# Altium project WARROX.PrjPcb
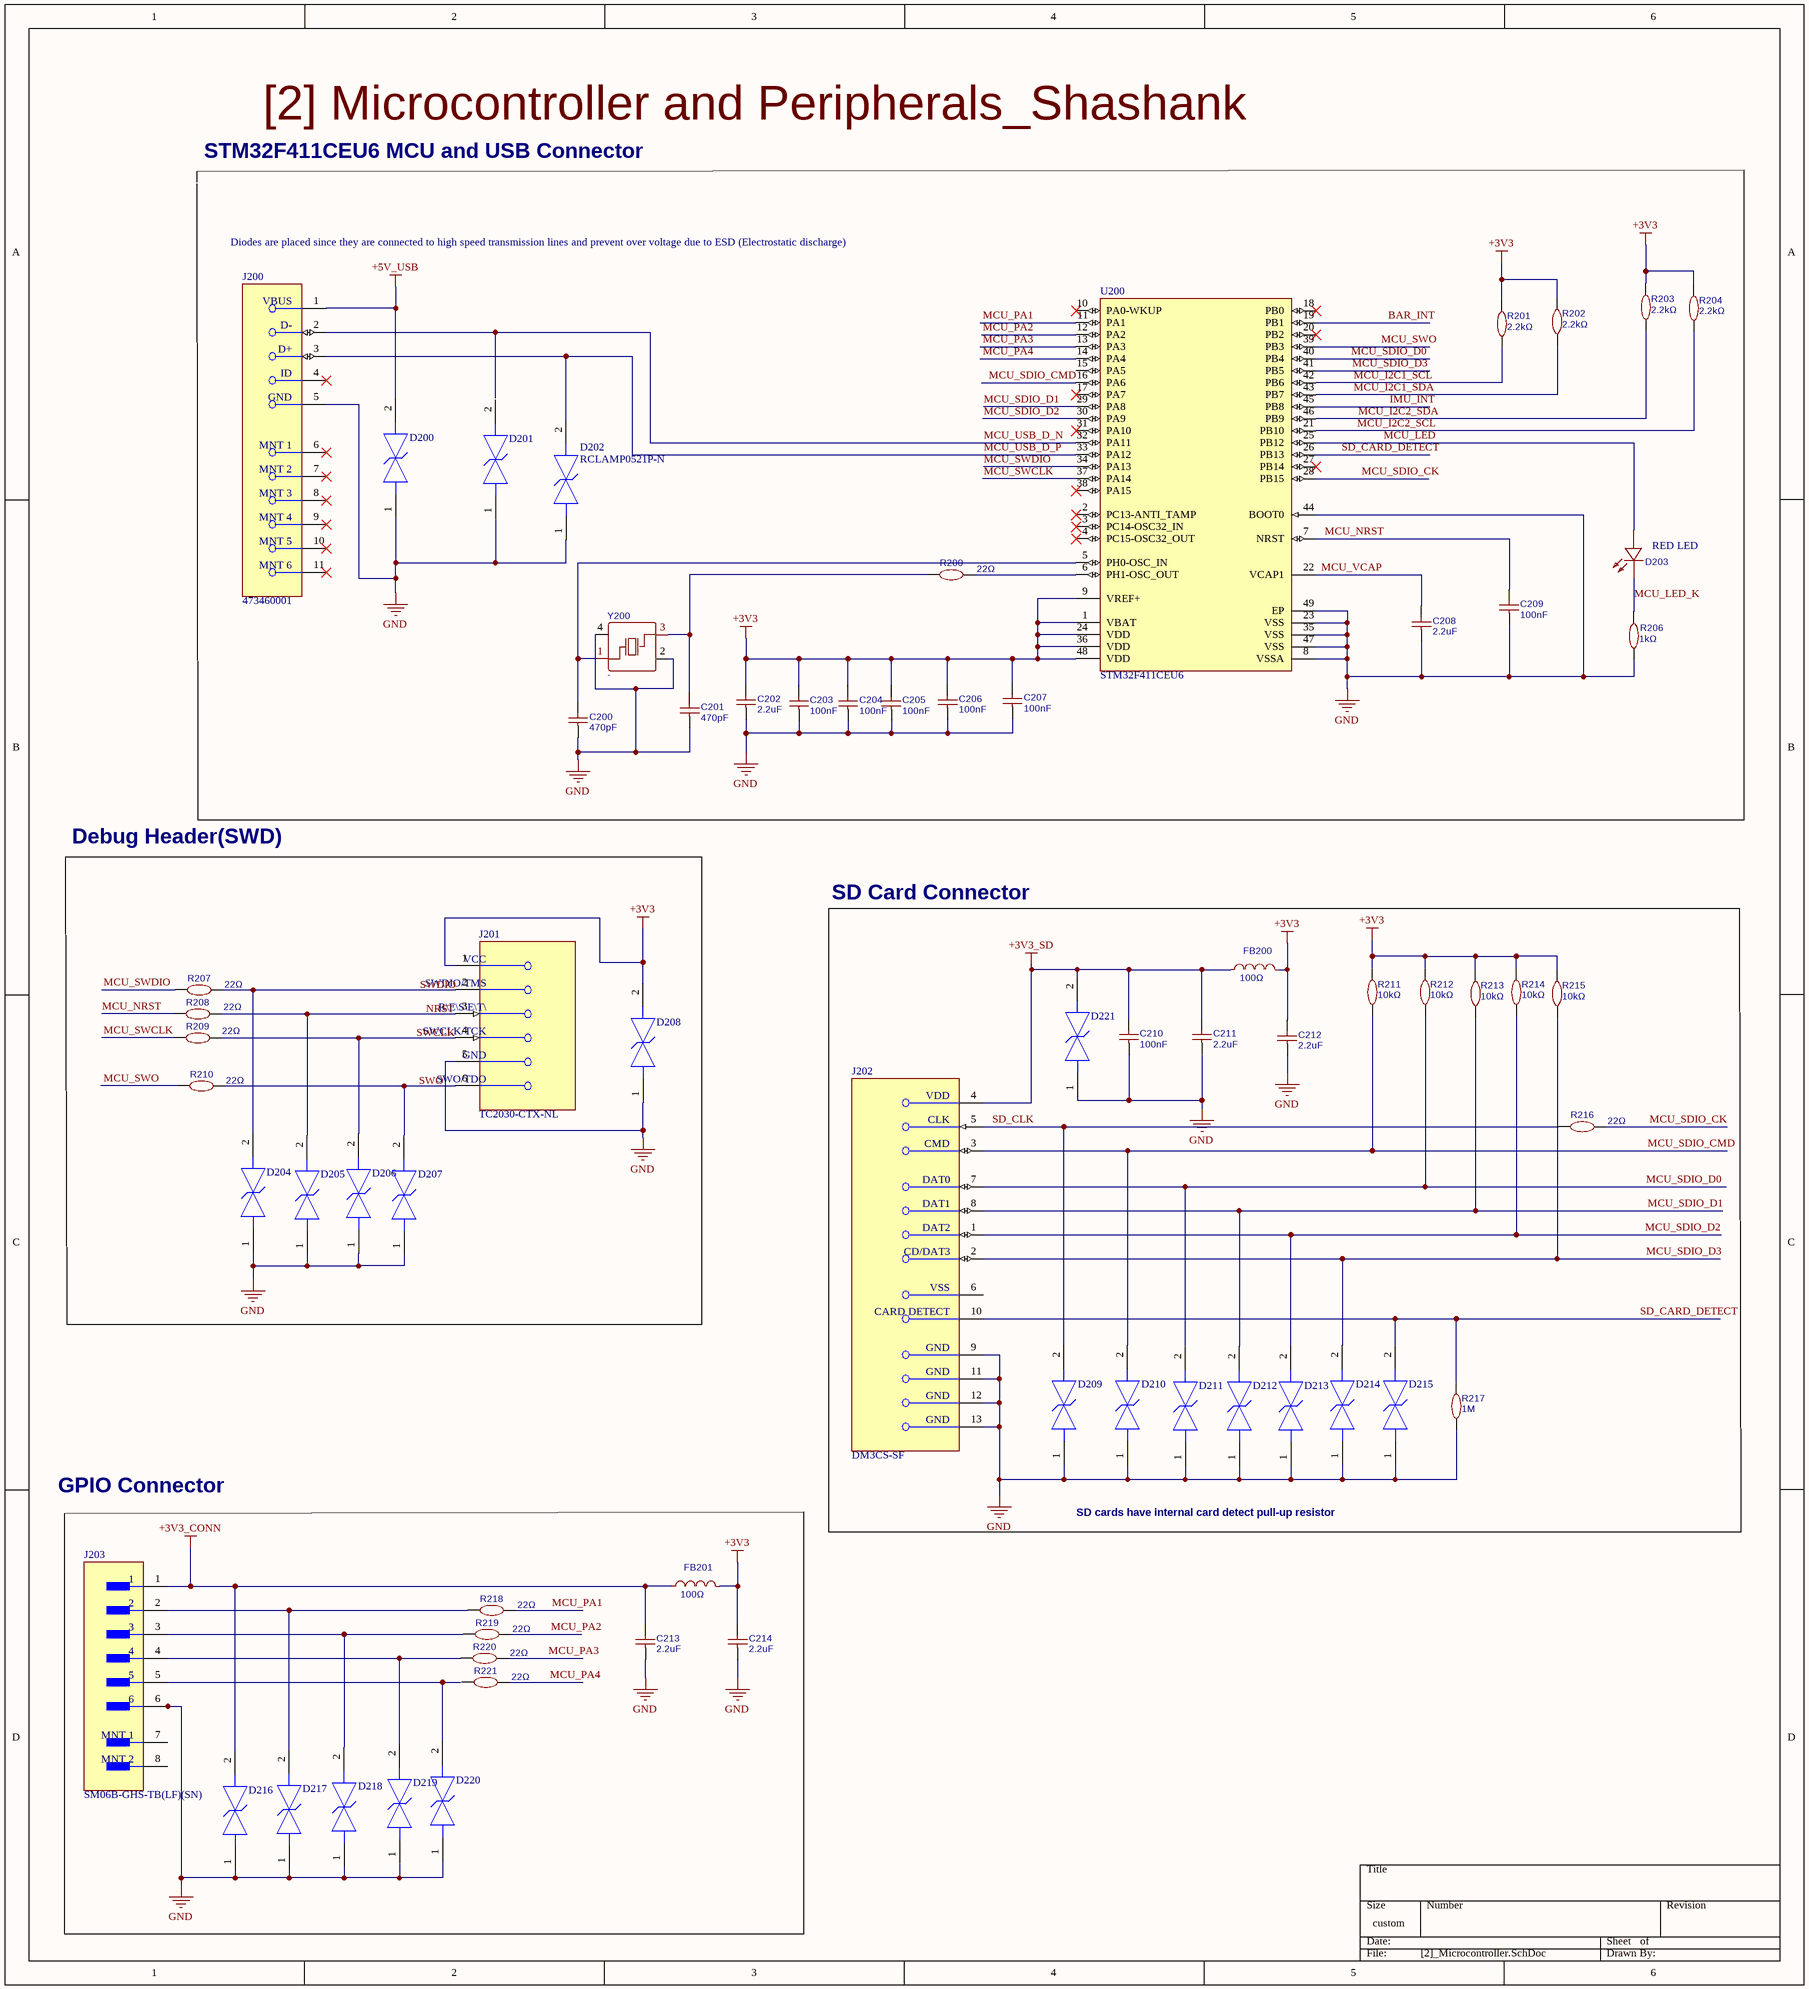
[diagram p0: [2]_Microcontroller.SchDoc]
2 sheets, 76 parts. Net scope: global (net labels, ports and power ports of the same name join across sheets).
Board files: WARROX.PcbDoc, WARROX.PcbDoc
Sheets:
  [2]_Microcontroller.SchDoc
  [3]_Sensors.SchDoc

## Sheet [2]_Microcontroller.SchDoc
size 381 x 419 mm; SheetNumber: 2; SheetTotal: 3

### Parts
C200  470pF  [C0402]
C201  470pF  [C0402]
C202  2.2uF  [C0603]
C203  100nF  [C0402]
C204  100nF  [C0402]
C205  100nF  [C0402]
C206  100nF  [C0402]
C207  100nF  [C0402]
C208  2.2uF  [C0603]
C209  100nF  [C0402]
C210  100nF  [C0402]
C211  2.2uF  [C0603]
C212  2.2uF  [C0603]
C213  2.2uF  [C0603]
C214  2.2uF  [C0603]
D200  PESD0402-140  [FP-PESD0402-MFG]  (value not drawn)
D201  PESD0402-140  [FP-PESD0402-MFG]  (value not drawn)
D202  RCLAMP0521P-N  [FP-PESD0402-MFG]
D203  FC-F1005UGK-520M5  [LED0402-RD]  (value not drawn)
D204  PESD0402-140  [FP-PESD0402-MFG]  (value not drawn)
D205  PESD0402-140  [FP-PESD0402-MFG]  (value not drawn)
D206  PESD0402-140  [FP-PESD0402-MFG]  (value not drawn)
D207  PESD0402-140  [FP-PESD0402-MFG]  (value not drawn)
D208  PESD0402-140  [FP-PESD0402-MFG]  (value not drawn)
D209  PESD0402-140  [FP-PESD0402-MFG]  (value not drawn)
D210  PESD0402-140  [FP-PESD0402-MFG]  (value not drawn)
D211  PESD0402-140  [FP-PESD0402-MFG]  (value not drawn)
D212  PESD0402-140  [FP-PESD0402-MFG]  (value not drawn)
D213  PESD0402-140  [FP-PESD0402-MFG]  (value not drawn)
D214  PESD0402-140  [FP-PESD0402-MFG]  (value not drawn)
D215  PESD0402-140  [FP-PESD0402-MFG]  (value not drawn)
D216  PESD0402-140  [FP-PESD0402-MFG]  (value not drawn)
D217  PESD0402-140  [FP-PESD0402-MFG]  (value not drawn)
D218  PESD0402-140  [FP-PESD0402-MFG]  (value not drawn)
D219  PESD0402-140  [FP-PESD0402-MFG]  (value not drawn)
D220  PESD0402-140  [FP-PESD0402-MFG]  (value not drawn)
D221  PESD0402-140  [FP-PESD0402-MFG]  (value not drawn)
FB200  100Ω  [L0603]
FB201  100Ω  [L0603]
J200  473460001  [FP-473460001-MFG]
J201  TC2030-CTX-NL  [FP-TC2030-CTX-NL-MFG]
J202  DM3CS-SF  [FP-DM3CS-SF-MFG]
J203  SM06B-GHS-TB(LF)(SN)  [FP-SM06B-GHS-TB_LF_SN-MFG]
R200  22Ω  [R0402]
R201  2.2kΩ  [R0402]
R202  2.2kΩ  [R0402]
R203  2.2kΩ  [R0402]
R204  2.2kΩ  [R0402]
R206  1kΩ  [R0402]
R207  22Ω  [R0402]
R208  22Ω  [R0402]
R209  22Ω  [R0402]
R210  22Ω  [R0402]
R211  10kΩ  [R0402]
R212  10kΩ  [R0402]
R213  10kΩ  [R0402]
R214  10kΩ  [R0402]
R215  10kΩ  [R0402]
R216  22Ω  [R0402]
R217  1M  [R0402]
R218  22Ω  [R0402]
R219  22Ω  [R0402]
R220  22Ω  [R0402]
R221  22Ω  [R0402]
U200  STM32F411CEU6  [STM-UFQFPN48_L]
Y200  -  [OSC-SMD_4P-L3.2-W2.5-BL]

### Blocks framed on the sheet
STM32F411CEU6 MCU and USB Connector: C200-C209 D200-D203 J200 R200-R204 R206 U200 Y200
Debug Header(SWD): D204-D208 J201 R207-R210
SD Card Connector: C210-C212 D209-D215 D221 FB200 J202 R211-R217

### Nets
+3V3: C202.2 C203.2 C204.2 C205.2 C206.2 C207.2 C212.2 C214.2 D208.2 FB200.2 FB201.2 J201.1(VCC) R201.2 R202.2 R203.2 R204.2 R211.2 R212.2 R213.2 R214.2 R215.2 U200.1(VBAT) U200.9(VREF+) U200.24(VDD) U200.36(VDD) U200.48(VDD)
+3V3_CONN: C213.2 D216.2 FB201.1 J203.1
+3V3_SD: C210.2 C211.2 D221.2 FB200.1 J202.4(VDD)
+5V_USB: D200.2 J200.1(VBUS)
GND: C200.1 C201.1 C202.1 C203.1 C204.1 C205.1 C206.1 C207.1 C208.1 C209.1 C210.1 C211.1 C212.1 C213.1 C214.1 D200.1 D201.1 D202.1 D204.1 D205.1 D206.1 D207.1 D208.1 D209.1 D210.1 D211.1 D212.1 D213.1 D214.1 D215.1 D216.1 D217.1 D218.1 D219.1 D220.1 D221.1 J200.5(GND) J201.5(GND) J202.9(GND) J202.11(GND) J202.12(GND) J202.13(GND) J203.6 R206.1 R217.1 U200.8(VSSA) U200.23(VSS) U200.35(VSS) U200.44(BOOT0) U200.47(VSS) U200.49(EP) Y200.2(GND) Y200.4(GND)
BAR_INT: U200.19(PB1)
IMU_INT: U200.45(PB8)
MCU_I2C1_SCL: R201.1 U200.42(PB6)
MCU_I2C1_SDA: R202.1 U200.43(PB7)
MCU_I2C2_SCL: R204.1 U200.21(PB10)
MCU_I2C2_SDA: R203.1 U200.46(PB9)
MCU_LED: D203.2(A) U200.25(PB12)
MCU_LED_K: D203.1(K) R206.2
MCU_NRST: C209.2 R208.1 U200.7(NRST)
MCU_PA1: R218.2 U200.11(PA1)
MCU_PA2: R219.2 U200.12(PA2)
MCU_PA3: R220.2 U200.13(PA3)
MCU_PA4: R221.2 U200.14(PA4)
MCU_SDIO_CK: R216.2 U200.28(PB15)
MCU_SDIO_CMD: D210.2 J202.3(CMD) R211.1 U200.16(PA6)
MCU_SDIO_D0: D211.2 J202.7(DAT0) R212.1 U200.40(PB4)
MCU_SDIO_D1: D212.2 J202.8(DAT1) R213.1 U200.29(PA8)
MCU_SDIO_D2: D213.2 J202.1(DAT2) R214.1 U200.30(PA9)
MCU_SDIO_D3: D214.2 J202.2(CD/DAT3) R215.1 U200.41(PB5)
MCU_SWCLK: R209.1 U200.37(PA14)
MCU_SWDIO: R207.1 U200.34(PA13)
MCU_SWO: R210.1 U200.39(PB3)
MCU_USB_D_N: J200.2(D-) U200.32(PA11)
MCU_USB_D_P: D202.2 J200.3(D+) U200.33(PA12)
MCU_VCAP: C208.2 U200.22(VCAP1)
SD_CARD_DETECT: D215.2 J202.10(CARD_DETECT) R217.2 U200.26(PB13)
SD_CLK: D209.2 J202.5(CLK) R216.1
NetC200_2: C200.2 U200.5(PH0-OSC_IN) Y200.1(OSC1)
NetC201_2: C201.2 R200.1 Y200.3(OSC2)
NetD204_2: D204.2 J201.2(SWDIO/TMS) R207.2
NetD205_2: D205.2 J201.3(~{RESET}) R208.2
NetD206_2: D206.2 J201.4(SWCLK/TCK) R209.2
NetD207_2: D207.2 J201.6(SWO/TDO) R210.2
NetD217_2: D217.2 J203.2 R218.1
NetD218_2: D218.2 J203.3 R219.1
NetD219_2: D219.2 J203.4 R220.1
NetD220_2: D220.2 J203.5
NetR200_2: R200.2 U200.6(PH1-OSC_OUT)

Not connected (* = marked no-connect by the designer): D201 2; J200 4(ID)* 6(MNT_1)* 7(MNT_2)* 8(MNT_3)* 9(MNT_4)* 10(MNT_5)* 11(MNT_6)*; J202 6(VSS); J203 7(MNT_1) 8(MNT_2); R221 1; U200 2(PC13-ANTI_TAMP)* 3(PC14-OSC32_IN)* 4(PC15-OSC32_OUT)* 10(PA0-WKUP)* 15(PA5) 17(PA7)* 18(PB0)* 20(PB2)* 27(PB14)* 31(PA10)* 38(PA15)*

### Notes on the sheet
- [2] Microcontroller and Peripherals_Shashank
- Diodes are placed since they are connected to high speed transmission lines and prevent over voltage due to ESD (Electrostatic discharge)
- (near D203) RED LED
- GPIO Connector
- SD cards have internal card detect pull-up resistor
- Labels drawn without touching a wire or pin: NRST, SWCLK, SWDIO, SWO

### Library data of the parts
C200 C201 C203-C207 C209 C210 = 470pF: Manufacturer: FH(风华); Manufacturer Part: 0402B471K500NT; nameAlias: Value; Supplier: LCSC; Supplier Part: C1537; JLCPCB Part Class: Basic Part; link: https://lcsc.com/eda_search?q=C1537&%26type=1&ref=editor; spicePre: C; spiceSymbolName: 0402B471K500NT
C202 C208 C211-C214 = 2.2uF: Manufacturer Part: CL10A225KO8NNNC; Manufacturer: SAMSUNG(三星); nameAlias: Value; Supplier: LCSC; Supplier Part: C23630; JLCPCB Part Class: Basic Part; link: https://lcsc.com/eda_search?q=C23630&%26type=1&ref=editor; spicePre: C; spiceSymbolName: CL10A225KO8NNNC
D200 D201 D204-D221 = CMP-08607-000011-1: TVS DIODE 14V 40V 0402; Manufacturer: Littelfuse Inc.; Automotive Grade: Grade 1; Capacitance: 0.25pF; Value: 0.25pF; Direction: Bidirectional; Number Of Channels: 1; Temperature Range Low: -55°C; Lead Free: Yes; Temperature: -55°C to +125°C; Digikey Description: TVS DIODE 14V 40V 0402; Automotive: Yes; Device Class L2: TVS Diodes; Reverse Standoff Voltage: 14V; Device Class L1: Circuit Protection; Ipc Land Pattern Name: DIOC10050X33; Manufacturer Part Number: PESD0402-140; Breakdown Voltage: 14V; Height: 0.43mm; Clamping Voltage: 40V; RoHS: TRUE; Temperature Range High: +125°C; Device Class L3: unset; Octopart: https://octopart.com/pesd0402-140-littelfuse-74215061; Package: PESD0402; ComponentLink2URL: https://www.littelfuse.com/~/media/electronics/datasheets/polymer_esd_suppressors/littelfuse_polymer_esd_suppressor_pesd_catalog_datasheet.pdf.pdf; Category: Diode; ComponentLink2Description: Datasheet
D202 = CMP-08607-000011-1: TVS DIODE 14V 40V 0402; Manufacturer Part Number: PESD0402-140; Manufacturer: Littelfuse Inc.; Automotive Grade: Grade 1; Capacitance: 0.25pF; Value: 0.25pF; Direction: Bidirectional; Number Of Channels: 1; Temperature Range Low: -55°C; Lead Free: Yes; Temperature: -55°C to +125°C; Digikey Description: TVS DIODE 14V 40V 0402; Automotive: Yes; Device Class L2: TVS Diodes; Reverse Standoff Voltage: 14V; Device Class L1: Circuit Protection; Ipc Land Pattern Name: DIOC10050X33; Breakdown Voltage: 14V; Height: 0.43mm; Clamping Voltage: 40V; RoHS: TRUE; Temperature Range High: +125°C; Device Class L3: unset; Octopart: https://octopart.com/pesd0402-140-littelfuse-74215061; Package: PESD0402; ComponentLink2URL: https://www.littelfuse.com/~/media/electronics/datasheets/polymer_esd_suppressors/littelfuse_polymer_esd_suppressor_pesd_catalog_datasheet.pdf.pdf; Category: Diode; ComponentLink2Description: Datasheet
D203 = FC-F1005UGK-520M5: Manufacturer: 国星光电; Manufacturer Part: NCD0402G1; Contributor: LCSC; Supplier: LCSC; Supplier Part: C130723; JLCPCB Part Class: Extended Part; link: https://lcsc.com/eda_search?q=C130723&%26type=1&ref=editor; spicePre: L; spiceSymbolName: FC-F1005UGK-520M5
FB200 FB201 = 120Ω: Manufacturer: Sunlord(顺络); Manufacturer Part: PZ1608D121-2R0TF; nameAlias: Value; Supplier: LCSC; Supplier Part: C42102; JLCPCB Part Class: Extended Part; spicePre: L; spiceSymbolName: PZ1608D121-2R0TF
J200 = CMP-2000-05246-2: CONN RCPT USB2.0 MICRO B SMD R/A; Manufacturer: Molex; Conn Orientation: Right Angle; Is Female: yes; Shielding: true; Pitch: 0.65mm; Number Of Contacts: 5; Voltage Rating: 30V; Current Rating: 1.8A; Device Class L2: USB Connectors; Digikey Description: CONN RCPT USB2.0 MICRO B SMD R/A; Height: 2.945mm; RoHS: TRUE; ComponentLink2Description: Datasheet; Octopart: https://octopart.com/47346-0001-molex-7164928; Automotive: No; Package: 0; Category: Conn; Device Class L1: Connectors; Usb Standard: USB 2.0; Temperature: -30°C to +85°C; Temperature Range Low: -30°C; Footprint Url: https://www.molex.com/pdm_docs/sd/473460001_sd.pdf; ComponentLink2URL: https://www.molex.com/webdocs/datasheets/pdf/en-us/0473460001_IO_CONNECTORS.pdf; Lead Free: Yes; Manufacturer Part Number: 473460001; Contact Material: Gold,Nickel; Temperature Range High: +85°C; Device Class L3: unset
J201 = CMP-205963-000001-1: 6-Pin “No legs” TC2030 Plug-of-Nails™ Cable for use with ARM Cortex processors
J202 = CMP-11597-000003-1: CONN MICRO SD CARD HINGED TYPE; Pitch: 1.1mm; Connector Type: Connector; Current Rating: 500mA; Voltage Rating (AC): 125V; Gender: Female; Insulation Resistance: 1GR; Number of Positions: 8; Contact Resistance: 100mR; Packaging: Tape and Reel; Flammability Rating: UL94 V-0; Lead Free: Lead Free; Min Operating Temperature: -25°C; Orientation: Right Angle; Width: 13.8mm; Number of Rows: 1; Housing Material: Polymer; Package Quantity: 1; Mount: Surface Mount; Max Current Rating: 500mA; Radiation Hardening: No; Max Operating Temperature: 85°C; Contact Plating: Gold; Depth: 1.83mm; Contact Material: Gold; Length: 14.1mm; Number of Contacts: 8; Termination: Solder
J203 = CMP-17439-000061-1: CONN HEADER SMD R/A 6POS 1.25MM; Number of Contacts: 6; Voltage Rating: 50V; Current Rating: 1A; Connector Type: Outer Shroud Contact; Contact Resistance: 50mR; Orientation: Right Angle; Max Operating Temperature: 85°C; Mount: Surface Mount; Packaging: Tape and Reel; Contact Plating: Tin; Depth: 4.05mm; Max Voltage Rating (AC): 50V; Lead Free: Lead Free; Pitch: 1.25mm; Number of Positions: 6; Max Current Rating: 1A; Termination: Solder; Min Operating Temperature: -25°C; Housing Color: Beige; Fastening Type: Ramp; Length: 10.75mm; Color: Natural; Contact Material: Bronze; Housing Material: Polyamide; Number of Rows: 1
R200-R204 R206-R221 = 1kΩ: Manufacturer: UNI-ROYAL(厚声); Manufacturer Part: 0402WGF1001TCE; nameAlias: Value; Supplier: LCSC; Supplier Part: C11702; JLCPCB Part Class: Basic Part; link: https://lcsc.com/eda_search?q=C11702&%26type=1&ref=editor; spicePre: R; spiceSymbolName: 0402WGF1001TCE
U200 = CMP-0243-00165-1: ARM Cortex-M4 32-bit MCU+FPU, 512 KB Flash, 128 KB RAM, 36 I/Os, 48-Pin UFQFPN, -40 to 85 degC, Tray; Operating Frequency(F) (Processor speed) (MHz): 100; FLASH Size (Prog) (kB): 512; Internal RAM Size (kB): 128; I/Os (High Current): 36; Supply Voltage(Vcc) min (V): 1.7; Package Reference: 48-Pin Ultra Thin Fine Pitch Quad Flat No-Lead, 7 x 7 x 0.6 mm Body, 0.5 mm Pitch, Exposed Pad; ComponentLink1Description: Manufacturer URL; ComponentLink1URL: http://www.st.com/; Packing: Tray; Package Description: UFQFPN48; Core: ARM Cortex-M4; ComponentLink2Description: Datasheet; ComponentLink2URL: http://www.st.com/st-web-ui/static/active/en/resource/technical/document/datasheet/DM00115249.pdf; DatasheetVersion: Rev. 6; Mounting Technology: Surface Mount
Y200 = Cystal Osc: Manufacturer: HELE(台湾加高); Manufacturer Part: X3Z016000B91H-U; nameAlias: Value; Contributor: LCSC; Supplier: LCSC; Supplier Part: C254221; JLCPCB Part Class: Extended Part; link: https://lcsc.com/eda_search?q=C254221&%26type=1&ref=editor; spicePre: X; spiceSymbolName: X3Z016000B91H-U

## Sheet [3]_Sensors.SchDoc
size A4; SheetNumber: 3; SheetTotal: 3
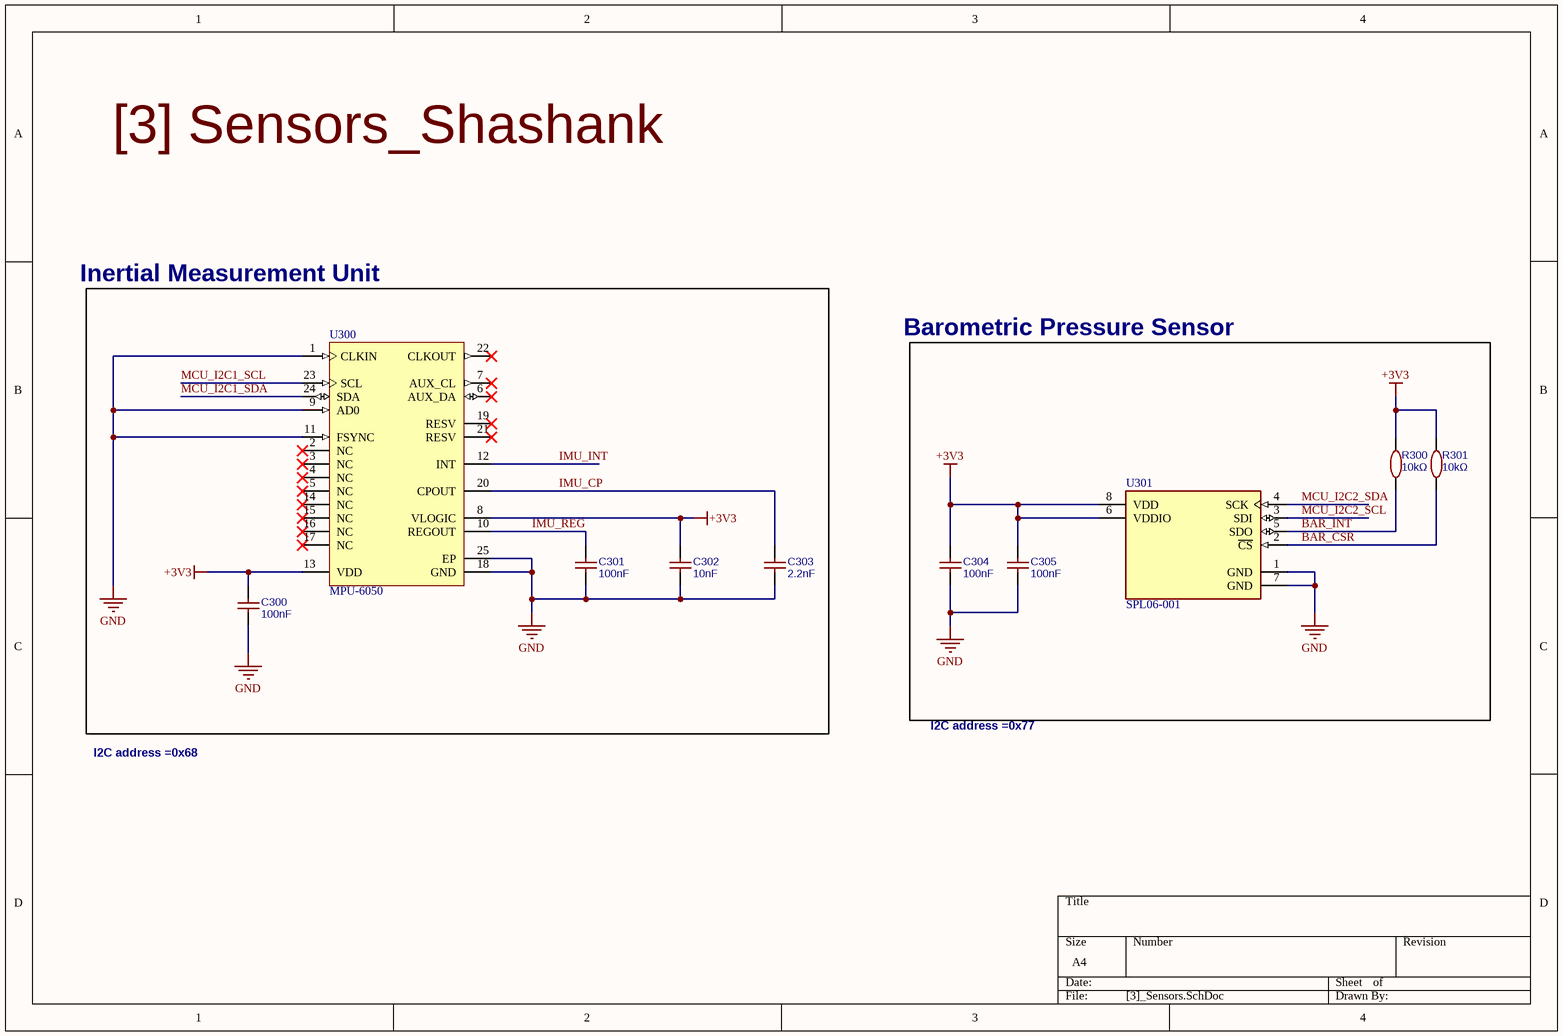
[diagram p1: [3]_Sensors.SchDoc]

### Parts
C300  100nF  [C0402]
C301  100nF  [C0402]
C302  10nF  [C0402]
C303  2.2nF  [C0402]
C304  100nF  [C0402]
C305  100nF  [C0402]
R300  10kΩ  [R0402]
R301  10kΩ  [R0402]
U300  MPU-6050  [IS-QFN-24_V]
U301  SPL06-001  [FP-BMP280-MFG]

### Nets
+3V3: C300.2 C302.2 C304.2 C305.2 R300.2 R301.2 U300.8(VLOGIC) U300.13(VDD) U301.6(VDDIO) U301.8(VDD)
GND: C300.1 C301.1 C302.1 C303.1 C304.1 C305.1 U300.1(CLKIN) U300.9(AD0) U300.11(FSYNC) U300.18(GND) U300.25(EP) U301.1(GND) U301.7(GND)
BAR_CSR: R301.1 U301.2(~{CS})
BAR_INT: R300.1 U301.5(SDO)
IMU_CP: C303.2 U300.20(CPOUT)
IMU_INT: U300.12(INT)
IMU_REG: C301.2 U300.10(REGOUT)
MCU_I2C1_SCL: U300.23(SCL)
MCU_I2C1_SDA: U300.24(SDA)
MCU_I2C2_SCL: U301.3(SDI)
MCU_I2C2_SDA: U301.4(SCK)

Not connected (* = marked no-connect by the designer): U300 2(NC)* 3(NC)* 4(NC)* 5(NC)* 6(AUX_DA)* 7(AUX_CL)* 14(NC)* 15(NC)* 16(NC)* 17(NC)* 19(RESV)* 21(RESV)* 22(CLKOUT)*

### Notes on the sheet
- [3] Sensors_Shashank
- Inertial Measurement Unit
- Barometric Pressure Sensor
- I2C address =0x68
- I2C address =0x77

### Library data of the parts
C300-C305 = 470pF: as C200 on sheet [2]_Microcontroller; Supplier: LCSC; Supplier Part: C1537; JLCPCB Part Class: Basic Part; link: https://lcsc.com/eda_search?q=C1537&%26type=1&ref=editor; spicePre: C; spiceSymbolName: 0402B471K500NT
R300 R301 = 1kΩ: as R200 on sheet [2]_Microcontroller; Supplier: LCSC; Supplier Part: C11702; JLCPCB Part Class: Basic Part; link: https://lcsc.com/eda_search?q=C11702&%26type=1&ref=editor; spicePre: R; spiceSymbolName: 0402WGF1001TCE
U300 = CMP-1753-00002-2: 3-Axis Gyroscope, Accelerometer and a Digital Motion Processor(TM) (DMP), 2.375 to 3.46 V, -40 to 85 degC, 24-Pin QFN, RoHS, Tape and Reel; Manufacturer: InvenSense; Featured Product: MPU-60506-Axis,IntegratedI²CSolution; Other Names: 1428-1007-2 / MPU6050; Sensor Type: MotionTracking; Online Catalog: MPU-6000™Series; Unit PriceUSD: Digital; Datasheet Version: Rev. 3.3, 05/2012; Category: Sensors,Transducers; Datasheet URL: http://datasheet.octopart.com/MPU-6050-InvenSense-datasheet-14421344.pdf; Family: Multifunction; Standard Package: 5,000; Manufacturer URL: http://www.invensense.com/; Output Type: Digital; Dynamic Catalog: MPU-6000™Series
U301 = CMP-2000-05076-3: SENSOR PRESSURE ABS; Operating Pressure: 15.95PSI; Pressure Type: Absolute; Output Type: SPI; Max Pressure: 290.08PSI; Port Style: No Port; Case/Package: SMD/SMT; Lead Free: Lead Free; Termination: SMD/SMT; Min Operating Temperature: -40°C; Number of Pins: 8; Max Operating Temperature: 85°C

## Nets that join several sheets
+3V3: [2]_Microcontroller (26 pins), [3]_Sensors (10 pins)
GND: [2]_Microcontroller (53 pins), [3]_Sensors (13 pins)
BAR_INT: [2]_Microcontroller (U200.19), [3]_Sensors (R300.1 U301.5)
IMU_INT: [2]_Microcontroller (U200.45), [3]_Sensors (U300.12)
MCU_I2C1_SCL: [2]_Microcontroller (R201.1 U200.42), [3]_Sensors (U300.23)
MCU_I2C1_SDA: [2]_Microcontroller (R202.1 U200.43), [3]_Sensors (U300.24)
MCU_I2C2_SCL: [2]_Microcontroller (R204.1 U200.21), [3]_Sensors (U301.3)
MCU_I2C2_SDA: [2]_Microcontroller (R203.1 U200.46), [3]_Sensors (U301.4)